# Altium schematic sheet Sender_Top.SchDoc
size A4
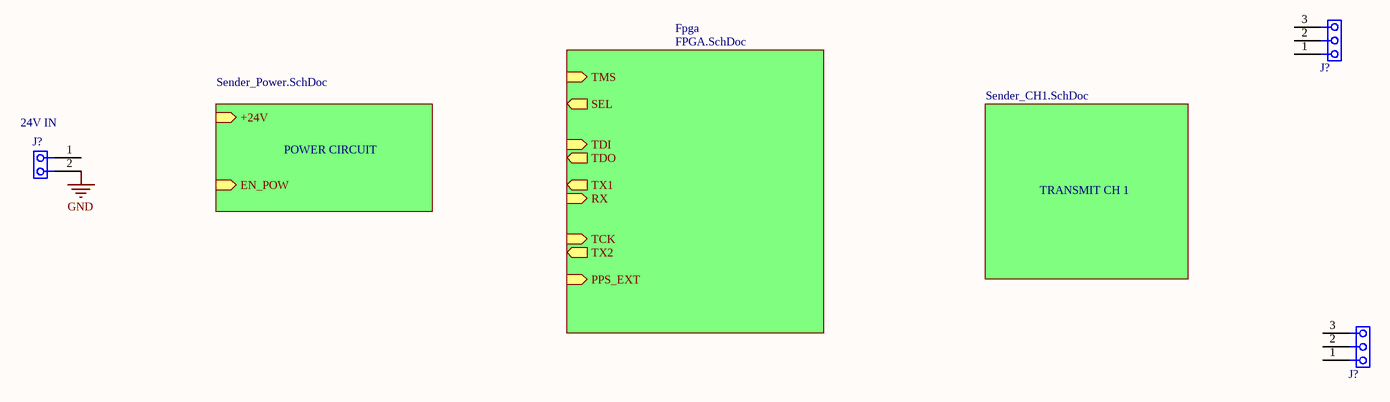
[diagram p0: Sender_Top.SchDoc]

## Parts
(Parts that share a designator on the sheet are numbered #1, #2 ... from top to bottom, then left to right.)
J?#1  CONN 3x1  [WAGO-3_pins]  (value not drawn)
J?#2  24V IN  [WAGO_2_pins]
J?#3  CONN 3x1  [WAGO-3_pins]  (value not drawn)

## Sub-sheets
Fpga = FPGA.SchDoc: TMS (in), TCK (in), TDI (in), TDO (out), SEL (out), TX1 (out), RX (in), TX2 (out), PPS_EXT (in)
POWER CIRCUIT = Sender_Power.SchDoc: +24V (in), EN_POW (in)
TRANSMIT CH 1 = Sender_CH1.SchDoc: no entries

## Nets
GND: J?#2.2(Vout)

Not connected (* = marked no-connect by the designer): J?#1 1(Vout) 2(Vout) 3(Vout); J?#2 1(Vout); J?#3 1(Vout) 2(Vout) 3(Vout)

## Library data of the parts
J?#1 J?#3 = 3x1 connector
J?#2 = 2x1 connector